# Altium schematic sheet Usb.SchDoc: USB
size A4; Author: MOG; CompanyName: GIE GROUP; DrawnBy: MOG; Organization: Gie SA; Address1: Galicia 52; Address2: Mar del Plata; Address3: Buenos Aires; Address4: Argentina; DocumentNumber: 12; Revision: 0.0; SheetNumber: 14; SheetTotal: 14; Project: CP DATALOGGER; PageSetup: Record=PageOptions|CenterHorizontal=True|CenterVertical=True|PrintScale=0.94|XCorrection=1.00|YCorrection=1.00|PrintKind=0|BorderSize=5000000|LeftOffset=0|BottomOffset=0|Orientation=2|PaperLength=1000|PaperWidth=1000|Scale=100|PaperSource=7|PrintQuality=720|MediaType=1|DitherType=10|PaperKind=A4|PrintScaleMode=1
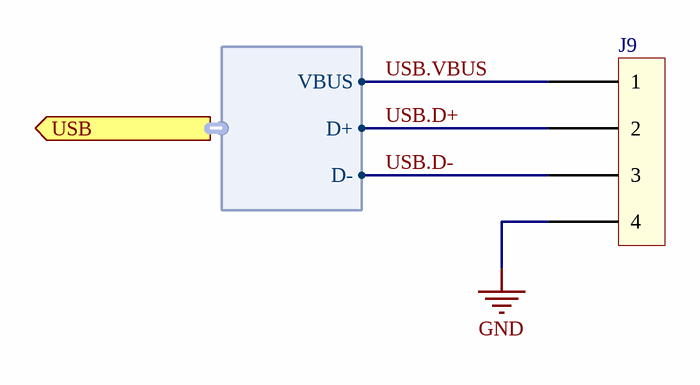
[diagram p0: Usb.SchDoc]

## Parts
J9  (no value)  [TE-640455-4]

## Ports
USB (out, harness USB)

## Harnesses
USB: D-, D+, VBUS

## Nets
GND: J9.4
USB.D+: J9.2 ; port USB.D+
USB.D-: J9.3 ; port USB.D-
USB.VBUS: J9.1 ; port USB.VBUS

## Notes on the sheet
- PROYECTO:
- Rev:
- NOMBRE:
- FECHA:
- REALIZO:
- REVISO:
- APROBO:
- PAG:
- HOJA:
- DE
- A4

## Library data of the parts
J9 = 640455-4: CONN HEADER RTANG 4POS .100 TIN; Mating Conn: 1375820-4; Supplier 1: Digi-Key; Supplier Part Number 1: A19452-ND; Supplier 2: Mouser; Supplier Part Number 2: 571-6404554